# Altium schematic sheet PCB_3U_ADC.schdoc: 3U ADC - top
size 420 x 297 mm; Author: G.K.; CompanyName: WUT; DrawnBy: G.K.; Organization: CERN; Address1: Warsaw Univeristy of Technology; Address2: Nowowiejska 15/19; DocumentNumber: 1; Revision: -; SheetNumber: 1; SheetTotal: 5; EDA_Number: ARTIQ; Projet: 3U ADC; ModifiedBy: -; CreateDate: XX/XX/XXXX; CheckedDate: -; Title2: 8 channel ADC v1.2; DivGrp: ISE; Designer: G.K.; ModifiedDate: -; ProjectName: 3U ADC
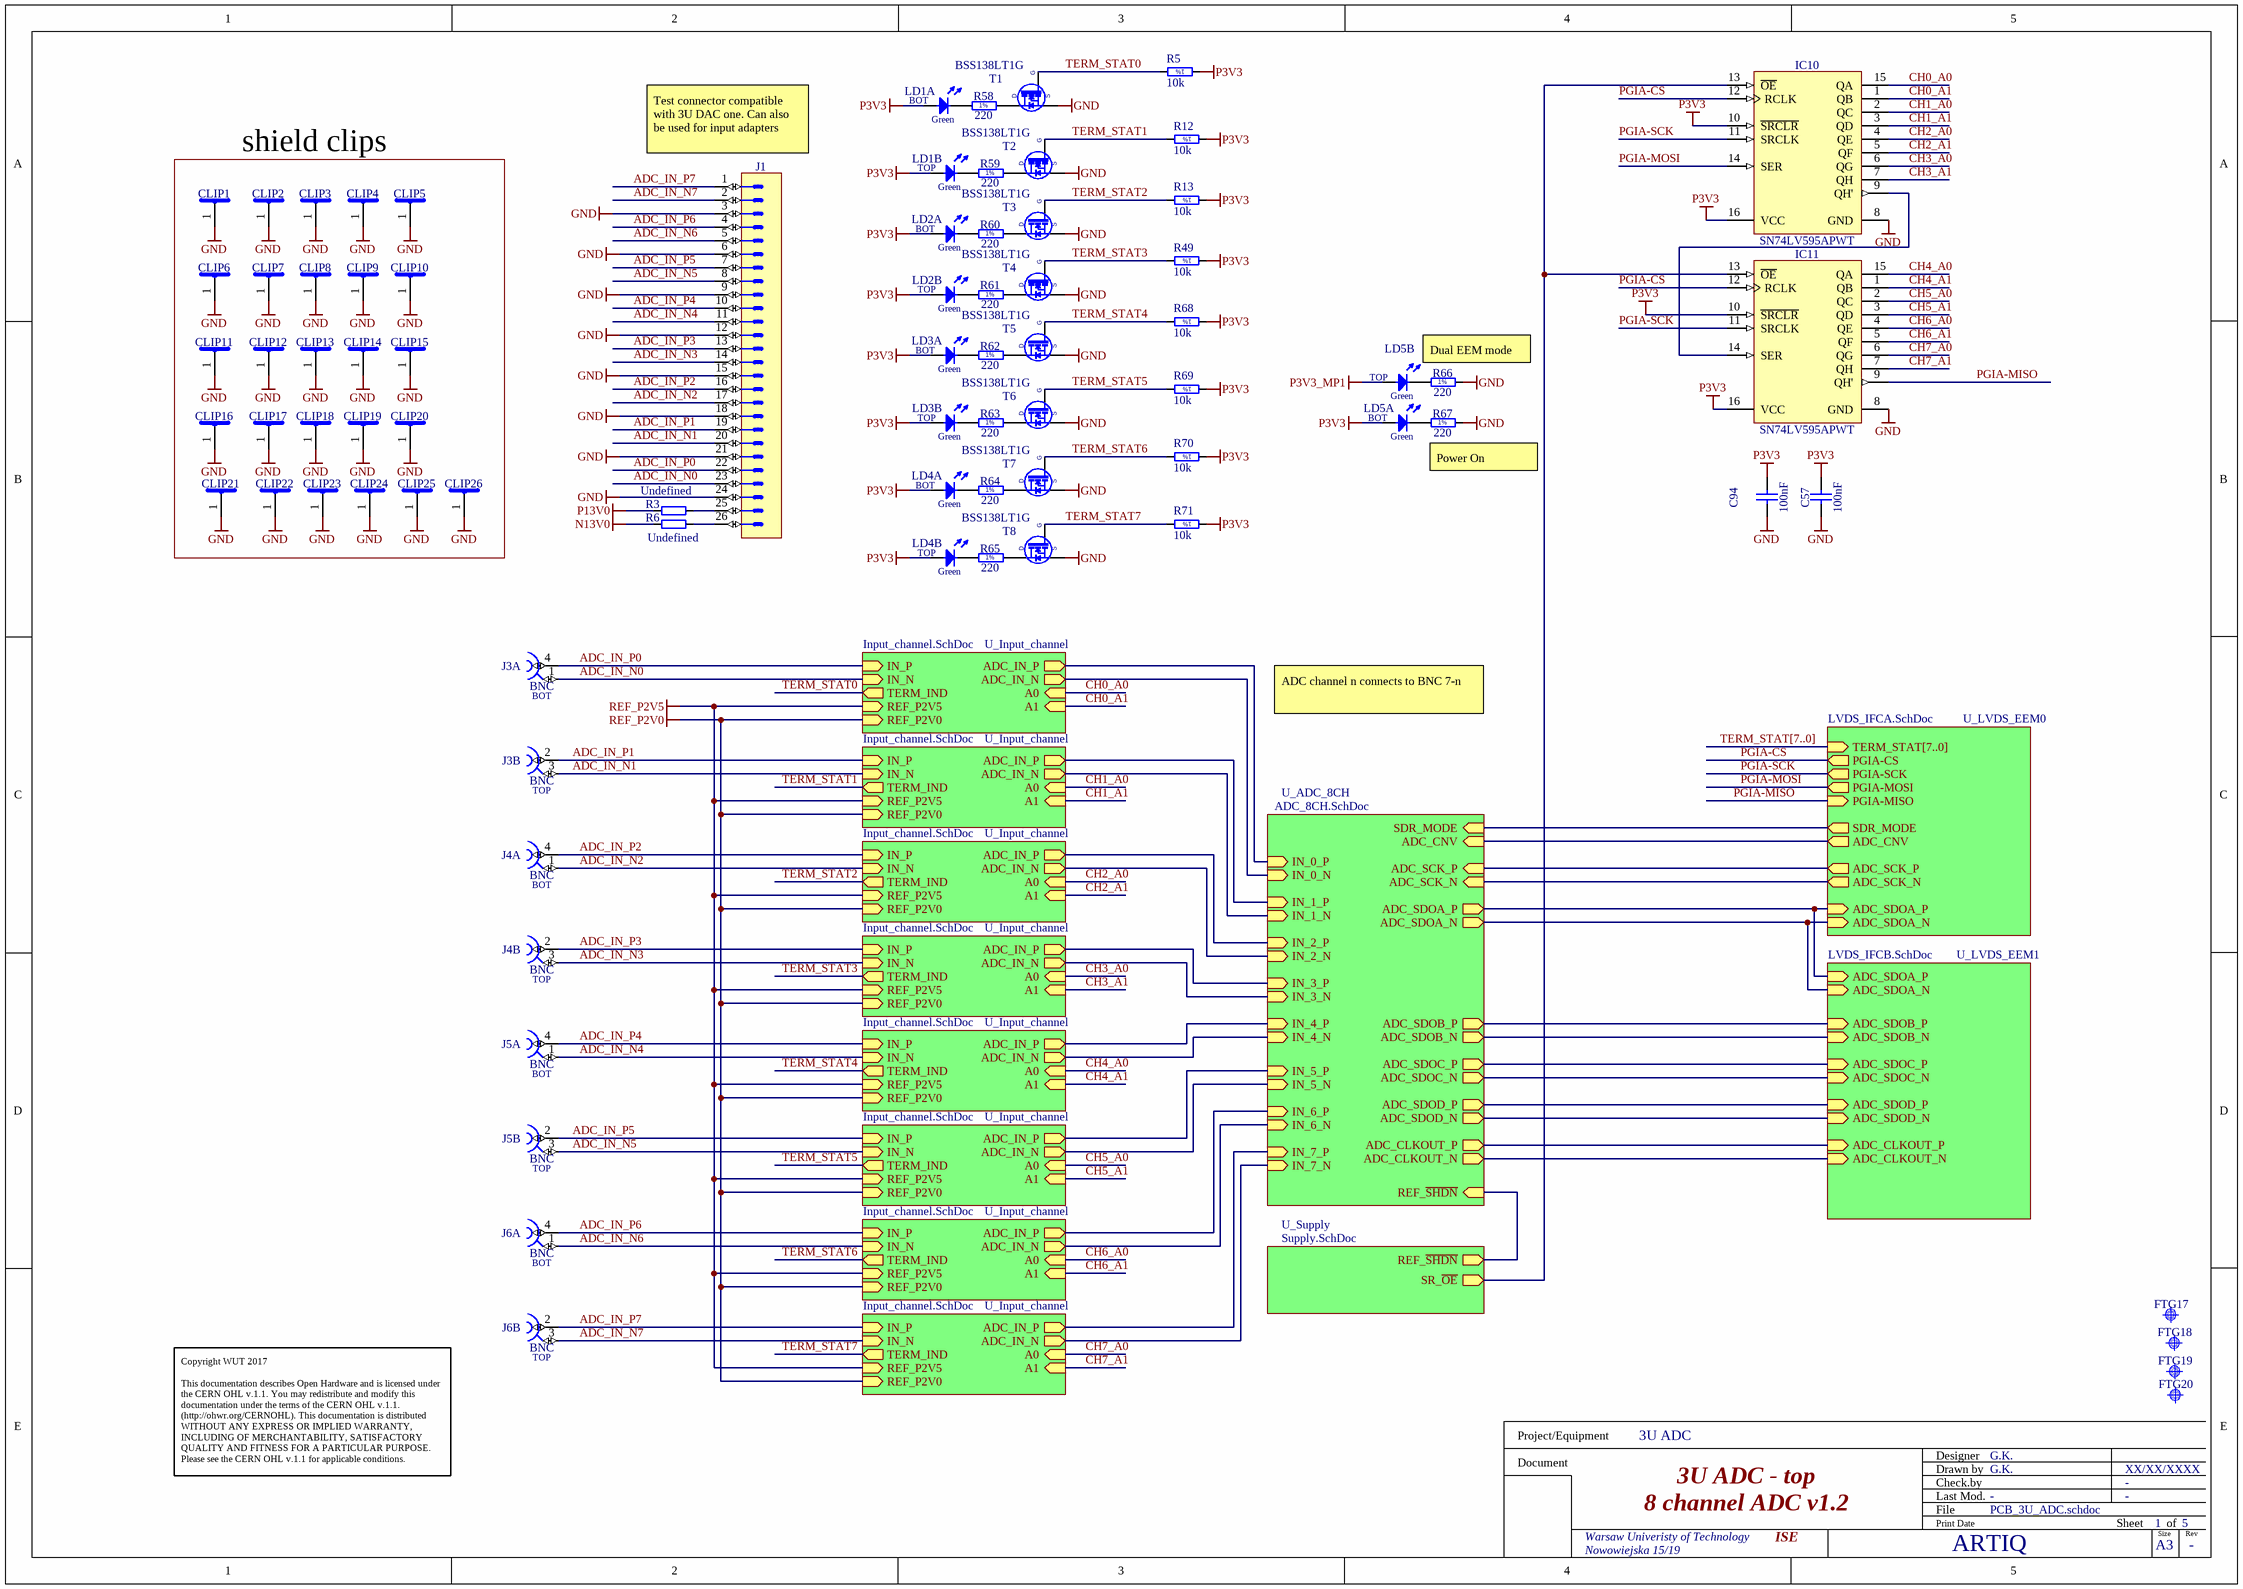
[diagram p0: PCB_3U_ADC.schdoc]

## Parts
C57  100nF  [CAPC1608X87N]
C94  100nF  [CAPC1608X87N]
CLIP1  S1411-46R  [CLIP_HOLLAND-SHIELDING_LC]  (value not drawn)
CLIP2  S1411-46R  [CLIP_HOLLAND-SHIELDING_LC]  (value not drawn)
CLIP3  S1411-46R  [CLIP_HOLLAND-SHIELDING_LC]  (value not drawn)
CLIP4  S1411-46R  [CLIP_HOLLAND-SHIELDING_LC]  (value not drawn)
CLIP5  S1411-46R  [CLIP_HOLLAND-SHIELDING_LC]  (value not drawn)
CLIP6  S1411-46R  [CLIP_HOLLAND-SHIELDING_LC]  (value not drawn)
CLIP7  S1411-46R  [CLIP_HOLLAND-SHIELDING_LC]  (value not drawn)
CLIP8  S1411-46R  [CLIP_HOLLAND-SHIELDING_LC]  (value not drawn)
CLIP9  S1411-46R  [CLIP_HOLLAND-SHIELDING_LC]  (value not drawn)
CLIP10  S1411-46R  [CLIP_HOLLAND-SHIELDING_LC]  (value not drawn)
CLIP11  S1411-46R  [CLIP_HOLLAND-SHIELDING_LC]  (value not drawn)
CLIP12  S1411-46R  [CLIP_HOLLAND-SHIELDING_LC]  (value not drawn)
CLIP13  S1411-46R  [CLIP_HOLLAND-SHIELDING_LC]  (value not drawn)
CLIP14  S1411-46R  [CLIP_HOLLAND-SHIELDING_LC]  (value not drawn)
CLIP15  S1411-46R  [CLIP_HOLLAND-SHIELDING_LC]  (value not drawn)
CLIP16  S1411-46R  [CLIP_HOLLAND-SHIELDING_LC]  (value not drawn)
CLIP17  S1411-46R  [CLIP_HOLLAND-SHIELDING_LC]  (value not drawn)
CLIP18  S1411-46R  [CLIP_HOLLAND-SHIELDING_LC]  (value not drawn)
CLIP19  S1411-46R  [CLIP_HOLLAND-SHIELDING_LC]  (value not drawn)
CLIP20  S1411-46R  [CLIP_HOLLAND-SHIELDING_LC]  (value not drawn)
CLIP21  S1411-46R  [CLIP_HOLLAND-SHIELDING_LC]  (value not drawn)
CLIP22  S1411-46R  [CLIP_HOLLAND-SHIELDING_LC]  (value not drawn)
CLIP23  S1411-46R  [CLIP_HOLLAND-SHIELDING_LC]  (value not drawn)
CLIP24  S1411-46R  [CLIP_HOLLAND-SHIELDING_LC]  (value not drawn)
CLIP25  S1411-46R  [CLIP_HOLLAND-SHIELDING_LC]  (value not drawn)
CLIP26  S1411-46R  [CLIP_HOLLAND-SHIELDING_LC]  (value not drawn)
FTG17  Use only in PCB  [FIDUCIAL_TOP_C100-200]  (value not drawn)
FTG18  Use only in PCB  [FIDUCIAL_TOP_S100-200]  (value not drawn)
FTG19  Use only in PCB  [FIDUCIAL_TOP_S200-400]  (value not drawn)
FTG20  Use only in PCB  [FIDUCIAL_TOP_S100-200]  (value not drawn)
IC10  SN74LV595APWT  [SOP65P640X120-16N]
IC11  SN74LV595APWT  [SOP65P640X120-16N]
J1  Header 26  [3M_N2526-6002RB]  (value not drawn)
J3  BNC  [RENHOTEC_RHT-610-0049]  (parts A,B of 2)
J4  BNC  [RENHOTEC_RHT-610-0049]  (parts A,B of 2)
J5  BNC  [RENHOTEC_RHT-610-0049]  (parts A,B of 2)
J6  BNC  [RENHOTEC_RHT-610-0049]  (parts A,B of 2)
LD1  Green/Green  [LED_DIALIGHT_571-0122F]  (value not drawn)  (parts A,B of 2)
LD2  Green/Green  [LED_DIALIGHT_571-0122F]  (value not drawn)  (parts A,B of 2)
LD3  Green/Green  [LED_DIALIGHT_571-0122F]  (value not drawn)  (parts A,B of 2)
LD4  Green/Green  [LED_DIALIGHT_571-0122F]  (value not drawn)  (parts A,B of 2)
LD5  Green/Green  [LED_DIALIGHT_571-0122F]  (value not drawn)  (parts A,B of 2)
R3  Undefined  [RESC1608X55N]
R5  10k  [RESC1005X40N]
R6  Undefined  [RESC1608X55N]
R12  10k  [RESC1005X40N]
R13  10k  [RESC1005X40N]
R49  10k  [RESC1005X40N]
R58  220  [RESC1608X55N]
R59  220  [RESC1608X55N]
R60  220  [RESC1608X55N]
R61  220  [RESC1608X55N]
R62  220  [RESC1608X55N]
R63  220  [RESC1608X55N]
R64  220  [RESC1608X55N]
R65  220  [RESC1608X55N]
R66  220  [RESC1608X55N]
R67  220  [RESC1608X55N]
R68  10k  [RESC1005X40N]
R69  10k  [RESC1005X40N]
R70  10k  [RESC1005X40N]
R71  10k  [RESC1005X40N]
T1  BSS138LT1G  [SOT95P240X110-3N]
T2  BSS138LT1G  [SOT95P240X110-3N]
T3  BSS138LT1G  [SOT95P240X110-3N]
T4  BSS138LT1G  [SOT95P240X110-3N]
T5  BSS138LT1G  [SOT95P240X110-3N]
T6  BSS138LT1G  [SOT95P240X110-3N]
T7  BSS138LT1G  [SOT95P240X110-3N]
T8  BSS138LT1G  [SOT95P240X110-3N]

## Blocks framed on the sheet
shield clips: CLIP1-CLIP26

## Sub-sheets
U_ADC_8CH = ADC_8CH.SchDoc: IN_1_P (in), IN_2_P (in), IN_0_P (in), IN_3_P (in), IN_4_P (in), IN_5_P (in), IN_6_P (in), IN_7_P (in), IN_0_N (in), IN_1_N (in), IN_2_N (in), IN_3_N (in), IN_6_N (in), IN_7_N (in), IN_4_N (in), IN_5_N (in), ADC_SDOA_P (out), ADC_SDOA_N (out), ADC_SCK_P (in), ADC_SCK_N (in), ADC_CNV (in), ADC_SDOB_N (out), ADC_SDOB_P (out), ADC_SDOC_P (out), ADC_SDOC_N (out), ADC_SDOD_N (out), ADC_SDOD_P (out), ADC_CLKOUT_P (out), ADC_CLKOUT_N (out), SDR_MODE (in), REF_~{SHDN} (in)
U_Input_channel = Input_channel.SchDoc: IN_N (in), A0 (in), A1 (in), IN_P (in), TERM_IND (out), ADC_IN_N (out), ADC_IN_P (out), REF_P2V5 (in), REF_P2V0 (in)
U_Input_channel = Input_channel.SchDoc: IN_N (in), A0 (in), A1 (in), IN_P (in), TERM_IND (out), ADC_IN_N (out), ADC_IN_P (out), REF_P2V5 (in), REF_P2V0 (in)
U_Input_channel = Input_channel.SchDoc: IN_N (in), A0 (in), A1 (in), IN_P (in), TERM_IND (out), ADC_IN_N (out), ADC_IN_P (out), REF_P2V5 (in), REF_P2V0 (in)
U_Input_channel = Input_channel.SchDoc: IN_N (in), A0 (in), A1 (in), IN_P (in), TERM_IND (out), ADC_IN_N (out), ADC_IN_P (out), REF_P2V5 (in), REF_P2V0 (in)
U_Input_channel = Input_channel.SchDoc: IN_N (in), A0 (in), A1 (in), IN_P (in), TERM_IND (out), ADC_IN_N (out), ADC_IN_P (out), REF_P2V5 (in), REF_P2V0 (in)
U_Input_channel = Input_channel.SchDoc: IN_N (in), A0 (in), A1 (in), IN_P (in), TERM_IND (out), ADC_IN_N (out), ADC_IN_P (out), REF_P2V5 (in), REF_P2V0 (in)
U_Input_channel = Input_channel.SchDoc: IN_N (in), A0 (in), A1 (in), IN_P (in), TERM_IND (out), ADC_IN_N (out), ADC_IN_P (out), REF_P2V5 (in), REF_P2V0 (in)
U_Input_channel = Input_channel.SchDoc: IN_N (in), A0 (in), A1 (in), IN_P (in), TERM_IND (out), ADC_IN_N (out), ADC_IN_P (out), REF_P2V5 (in), REF_P2V0 (in)
U_LVDS_EEM0 = LVDS_IFCA.SchDoc: TERM_STAT[7..0] (in), PGIA-CS (out), PGIA-SCK (out), PGIA-MOSI (out), PGIA-MISO (in), ADC_SDOA_N (in), ADC_SDOA_P (in), ADC_SCK_N (out), ADC_SCK_P (out), ADC_CNV (out), SDR_MODE (out)
U_LVDS_EEM1 = LVDS_IFCB.SchDoc: ADC_SDOB_P (in), ADC_SDOB_N (in), ADC_SDOC_P (in), ADC_SDOC_N (in), ADC_SDOD_P (in), ADC_SDOD_N (in), ADC_CLKOUT_P (in), ADC_CLKOUT_N (in), ADC_SDOA_N (in), ADC_SDOA_P (in)
U_Supply = Supply.SchDoc: REF_~{SHDN} (out), SR_~{OE} (out)

## Nets
GND: C57.1 C94.1 CLIP1.1 CLIP2.1 CLIP3.1 CLIP4.1 CLIP5.1 CLIP6.1 CLIP7.1 CLIP8.1 CLIP9.1 CLIP10.1 CLIP11.1 CLIP12.1 CLIP13.1 CLIP14.1 CLIP15.1 CLIP16.1 CLIP17.1 CLIP18.1 CLIP19.1 CLIP20.1 CLIP21.1 CLIP22.1 CLIP23.1 CLIP24.1 CLIP25.1 CLIP26.1 IC10.8(GND) IC11.8(GND) J1.3 J1.6 J1.9 J1.12 J1.15 J1.18 J1.21 J1.24 R66.2 R67.2 T1.2(S) T2.2(S) T3.2(S) T4.2(S) T5.2(S) T6.2(S) T7.2(S) T8.2(S)
N13V0: R6.2
P3V3: C57.2 C94.2 IC10.10(~{SRCLR}) IC10.16(VCC) IC11.10(~{SRCLR}) IC11.16(VCC) LD1.2(A) LD1.4(A) LD2.2(A) LD2.4(A) LD3.2(A) LD3.4(A) LD4.2(A) LD4.4(A) LD5.2(A) R5.1 R12.1 R13.1 R49.1 R68.1 R69.1 R70.1 R71.1
P3V3_MP1: LD5.4(A)
P13V0: R3.2
REF_P2V0: sheet U_Input_channel/REF_P2V0, sheet U_Input_channel/REF_P2V0, sheet U_Input_channel/REF_P2V0, sheet U_Input_channel/REF_P2V0, sheet U_Input_channel/REF_P2V0, sheet U_Input_channel/REF_P2V0, sheet U_Input_channel/REF_P2V0, sheet U_Input_channel/REF_P2V0
REF_P2V5: sheet U_Input_channel/REF_P2V5, sheet U_Input_channel/REF_P2V5, sheet U_Input_channel/REF_P2V5, sheet U_Input_channel/REF_P2V5, sheet U_Input_channel/REF_P2V5, sheet U_Input_channel/REF_P2V5, sheet U_Input_channel/REF_P2V5, sheet U_Input_channel/REF_P2V5
ADC_IN_N0: J1.23 J3.1 ; sheet U_Input_channel/IN_N
ADC_IN_N1: J1.20 J3.3 ; sheet U_Input_channel/IN_N
ADC_IN_N2: J1.17 J4.1 ; sheet U_Input_channel/IN_N
ADC_IN_N3: J1.14 J4.3 ; sheet U_Input_channel/IN_N
ADC_IN_N4: J1.11 J5.1 ; sheet U_Input_channel/IN_N
ADC_IN_N5: J1.8 J5.3 ; sheet U_Input_channel/IN_N
ADC_IN_N6: J1.5 J6.1 ; sheet U_Input_channel/IN_N
ADC_IN_N7: J1.2 J6.3 ; sheet U_Input_channel/IN_N
ADC_IN_P0: J1.22 J3.4 ; sheet U_Input_channel/IN_P
ADC_IN_P1: J1.19 J3.2 ; sheet U_Input_channel/IN_P
ADC_IN_P2: J1.16 J4.4 ; sheet U_Input_channel/IN_P
ADC_IN_P3: J1.13 J4.2 ; sheet U_Input_channel/IN_P
ADC_IN_P4: J1.10 J5.4 ; sheet U_Input_channel/IN_P
ADC_IN_P5: J1.7 J5.2 ; sheet U_Input_channel/IN_P
ADC_IN_P6: J1.4 J6.4 ; sheet U_Input_channel/IN_P
ADC_IN_P7: J1.1 J6.2 ; sheet U_Input_channel/IN_P
CH0_A0: IC10.15(QA) ; sheet U_Input_channel/A0
CH0_A1: IC10.1(QB) ; sheet U_Input_channel/A1
CH1_A0: IC10.2(QC) ; sheet U_Input_channel/A0
CH1_A1: IC10.3(QD) ; sheet U_Input_channel/A1
CH2_A0: IC10.4(QE) ; sheet U_Input_channel/A0
CH2_A1: IC10.5(QF) ; sheet U_Input_channel/A1
CH3_A0: IC10.6(QG) ; sheet U_Input_channel/A0
CH3_A1: IC10.7(QH) ; sheet U_Input_channel/A1
CH4_A0: IC11.15(QA) ; sheet U_Input_channel/A0
CH4_A1: IC11.1(QB) ; sheet U_Input_channel/A1
CH5_A0: IC11.2(QC) ; sheet U_Input_channel/A0
CH5_A1: IC11.3(QD) ; sheet U_Input_channel/A1
CH6_A0: IC11.4(QE) ; sheet U_Input_channel/A0
CH6_A1: IC11.5(QF) ; sheet U_Input_channel/A1
CH7_A0: IC11.6(QG) ; sheet U_Input_channel/A0
CH7_A1: IC11.7(QH) ; sheet U_Input_channel/A1
PGIA-CS: IC10.12(RCLK) IC11.12(RCLK) ; sheet U_LVDS_EEM0/PGIA-CS
PGIA-MISO: IC11.9(QH') ; sheet U_LVDS_EEM0/PGIA-MISO
PGIA-MOSI: IC10.14(SER) ; sheet U_LVDS_EEM0/PGIA-MOSI
PGIA-SCK: IC10.11(SRCLK) IC11.11(SRCLK) ; sheet U_LVDS_EEM0/PGIA-SCK
TERM_STAT0: R5.2 T1.1(G) ; sheet U_Input_channel/TERM_IND
TERM_STAT1: R12.2 T2.1(G) ; sheet U_Input_channel/TERM_IND
TERM_STAT2: R13.2 T3.1(G) ; sheet U_Input_channel/TERM_IND
TERM_STAT3: R49.2 T4.1(G) ; sheet U_Input_channel/TERM_IND
TERM_STAT4: R68.2 T5.1(G) ; sheet U_Input_channel/TERM_IND
TERM_STAT5: R69.2 T6.1(G) ; sheet U_Input_channel/TERM_IND
TERM_STAT6: R70.2 T7.1(G) ; sheet U_Input_channel/TERM_IND
TERM_STAT7: R71.2 T8.1(G) ; sheet U_Input_channel/TERM_IND
NetIC10_9: IC10.9(QH') IC11.14(SER)
NetIC10_13: IC10.13(~{OE}) IC11.13(~{OE}) ; sheet U_Supply/SR_~{OE}
NetJ1_25: J1.25 R3.1
NetJ1_26: J1.26 R6.1
NetLD1_1: LD1.1(C) R58.1
NetLD1_3: LD1.3(C) R59.1
NetLD2_1: LD2.1(C) R60.1
NetLD2_3: LD2.3(C) R61.1
NetLD3_1: LD3.1(C) R62.1
NetLD3_3: LD3.3(C) R63.1
NetLD4_1: LD4.1(C) R64.1
NetLD4_3: LD4.3(C) R65.1
NetLD5_1: LD5.1(C) R67.1
NetLD5_3: LD5.3(C) R66.1
NetR58_2: R58.2 T1.3(D)
NetR59_2: R59.2 T2.3(D)
NetR60_2: R60.2 T3.3(D)
NetR61_2: R61.2 T4.3(D)
NetR62_2: R62.2 T5.3(D)
NetR63_2: R63.2 T6.3(D)
NetR64_2: R64.2 T7.3(D)
NetR65_2: R65.2 T8.3(D)
(unnamed): sheet U_ADC_8CH/IN_1_P, sheet U_Input_channel/ADC_IN_P
(unnamed): sheet U_ADC_8CH/IN_2_P, sheet U_Input_channel/ADC_IN_P
(unnamed): sheet U_ADC_8CH/IN_0_P, sheet U_Input_channel/ADC_IN_P
(unnamed): sheet U_ADC_8CH/IN_3_P, sheet U_Input_channel/ADC_IN_P
(unnamed): sheet U_ADC_8CH/IN_4_P, sheet U_Input_channel/ADC_IN_P
(unnamed): sheet U_ADC_8CH/IN_5_P, sheet U_Input_channel/ADC_IN_P
(unnamed): sheet U_ADC_8CH/IN_6_P, sheet U_Input_channel/ADC_IN_P
(unnamed): sheet U_ADC_8CH/IN_7_P, sheet U_Input_channel/ADC_IN_P
(unnamed): sheet U_ADC_8CH/IN_0_N, sheet U_Input_channel/ADC_IN_N
(unnamed): sheet U_ADC_8CH/IN_1_N, sheet U_Input_channel/ADC_IN_N
(unnamed): sheet U_ADC_8CH/IN_2_N, sheet U_Input_channel/ADC_IN_N
(unnamed): sheet U_ADC_8CH/IN_3_N, sheet U_Input_channel/ADC_IN_N
(unnamed): sheet U_ADC_8CH/IN_6_N, sheet U_Input_channel/ADC_IN_N
(unnamed): sheet U_ADC_8CH/IN_7_N, sheet U_Input_channel/ADC_IN_N
(unnamed): sheet U_ADC_8CH/IN_4_N, sheet U_Input_channel/ADC_IN_N
(unnamed): sheet U_ADC_8CH/IN_5_N, sheet U_Input_channel/ADC_IN_N
(unnamed): sheet U_ADC_8CH/ADC_SDOA_P, sheet U_LVDS_EEM0/ADC_SDOA_P, sheet U_LVDS_EEM1/ADC_SDOA_P
(unnamed): sheet U_ADC_8CH/ADC_SDOA_N, sheet U_LVDS_EEM0/ADC_SDOA_N, sheet U_LVDS_EEM1/ADC_SDOA_N
(unnamed): sheet U_ADC_8CH/ADC_SCK_P, sheet U_LVDS_EEM0/ADC_SCK_P
(unnamed): sheet U_ADC_8CH/ADC_SCK_N, sheet U_LVDS_EEM0/ADC_SCK_N
(unnamed): sheet U_ADC_8CH/ADC_CNV, sheet U_LVDS_EEM0/ADC_CNV
(unnamed): sheet U_ADC_8CH/ADC_SDOB_N, sheet U_LVDS_EEM1/ADC_SDOB_N
(unnamed): sheet U_ADC_8CH/ADC_SDOB_P, sheet U_LVDS_EEM1/ADC_SDOB_P
(unnamed): sheet U_ADC_8CH/ADC_SDOC_P, sheet U_LVDS_EEM1/ADC_SDOC_P
(unnamed): sheet U_ADC_8CH/ADC_SDOC_N, sheet U_LVDS_EEM1/ADC_SDOC_N
(unnamed): sheet U_ADC_8CH/ADC_SDOD_N, sheet U_LVDS_EEM1/ADC_SDOD_N
(unnamed): sheet U_ADC_8CH/ADC_SDOD_P, sheet U_LVDS_EEM1/ADC_SDOD_P
(unnamed): sheet U_ADC_8CH/ADC_CLKOUT_P, sheet U_LVDS_EEM1/ADC_CLKOUT_P
(unnamed): sheet U_ADC_8CH/ADC_CLKOUT_N, sheet U_LVDS_EEM1/ADC_CLKOUT_N
(unnamed): sheet U_ADC_8CH/SDR_MODE, sheet U_LVDS_EEM0/SDR_MODE
(unnamed): sheet U_ADC_8CH/REF_~{SHDN}, sheet U_Supply/REF_~{SHDN}

## Buses and harness runs
bus TERM_STAT[7..0] = sheet U_LVDS_EEM0/TERM_STAT[7..0]

## Notes on the sheet
- (near J1) Test connector compatible with 3U DAC one. Can also be used for input adapters
- Dual EEM mode
- Power On
- ADC channel n connects to BNC 7-n
- Copyright WUT 2017
  This documentation describes Open Hardware and is licensed under the CERN OHL v.1.1. You may redistribute and modify this documentation under the terms of the CERN OHL v.1.1. (http://ohwr.org/CERNOHL). This documentation is distributed WITHOUT ANY EXPRESS OR IMPLIED WARRANTY, INCLUDING OF MERCHANTABILITY, SATISFACTORY QUALITY AND FITNESS FOR A PARTICULAR PURPOSE. Please see the CERN OHL v.1.1 for applicable conditions.
- Project/Equipment
- Document
- Designer
- Drawn by
- Check.by
- File
- Last Mod.
- Print Date
- Sheet
- Size
- A3
- of
- Rev
- (in symbol CON_BNC_DUAL, part A) BOT
- (in symbol CON_BNC_DUAL, part B) TOP
- (in symbol LED_DIALIGHT_571-0122F, part A) BOT; Green
- (in symbol LED_DIALIGHT_571-0122F, part B) TOP; Green
- (in symbol R0402_10K_1%_0.0625W_100PPM) 1%
- (in symbol R0603_220R_1%_0.1W_100PPM) 1%

## Library data of the parts
C57 C94 = CC0603_100NF_50V_10%_X7R: Non-polarised capacitor; Part Description: SMD Multilayer Chip Ceramic Capacitor; Manufacturer: GENERIC; Manufacturer1 Part Number: 223858615649; Voltage: 50V; TC: X7R; Tolerance: ±10%; Part Number: CC0603_100NF_50V_10%_X7R; Component Kind: Standard; Component Type: Standard; Pin Count: 2; Value: 100nF; Status: Preferred; Manufacturer Part Number: CC0603_100NF_50V_10%_X7R; Case: 0603; Mounted: Yes; Socket: No; SMD: Yes; Sense: No; Manufacturer1 Example: PHYCOMP; Manufacturer1 ComponentHeight: 0.87mm; HelpURL: \\cern.ch\dfs\Applications\Altium\Datasheets\CC0603_X7R_PHYCOMP.pdf; Author: CERN DEM JLC; CreateDate: 03.12.2007; LatestRevisionDate: 03.12.2007
CLIP1-CLIP26 = SHIELD_CLIP: Surface Mount Clip for PCB Screening Covers; Part Description: Surface Mount Clip for PCB Screening Covers, 1500 Serie; Manufacturer: HARWIN; PressFit: No; Table: Metal Screening Box; Part Number: S1411-46R; Component Kind: Standard; Component Type: Standard; Pin Count: 1; PackageDescription: Surface Mount Clip for PCB Screening Covers, 1500 Serie; Mounted: Yes; Socket: No; SMD: Yes; Status: None; Manufacturer Part Number: S1411-46R; ComponentHeight: 3.5mm; HelpURL: \\cern.ch\dfs\Applications\Altium\Datasheets\CLIP_HOLLAND-SHIELDING_LC.pdf; Author: CERN DEM JLC; CreateDate: 2013-06-25; LatestRevisionDate: 2013-06-25
FTG17 = FIDUCIAL_TARGET_C100-200: Fiducial Target; Part Description: Round Fiducial Target, Top Layer, 1.0mm, Top Solder 2.0mm, Keepout =2.0mm; Mounted: No; Part Number: FIDUCIAL_TARGET_C100-200; Component Kind: Standard (No BOM); Component Type: Standard (No BOM); Pin Count: 1; Family: Fiducial; Socket: No; SMD: Yes; Sense: No; Status: None; ComponentHeight: 0mm; HelpURL: Undefined; Author: CERN DEM JLC; CreateDate: 09.02.2010; LatestRevisionDate: 04.04.2012; PackageDescription: Round Fiducial Target, Top Layer, 1.0mm, Top Solder 2.0mm, Keepout =2.0mm
FTG18 FTG20 = FIDUCIAL_TARGET_S100-200: Fiducial Target; Part Description: Square Fiducial Target, Top Layer, 1.0mm, Top Solder 2.0mm, Keepout =2.0mm; Mounted: No; Part Number: FIDUCIAL_TARGET_S100-200; Component Kind: Standard (No BOM); Component Type: Standard (No BOM); Pin Count: 1; Family: Fiducial; Socket: No; SMD: Yes; Sense: No; Status: None; ComponentHeight: 0mm; HelpURL: Undefined; Author: CERN DEM JLC; CreateDate: 09.02.2010; LatestRevisionDate: 04.04.2012; PackageDescription: Square Fiducial Target, Top Layer, 1.0mm, Top Solder 2.0mm, Keepout =2.0mm
FTG19 = FIDUCIAL_TARGET_S200-400: Fiducial Target; Part Description: Square Fiducial Target, Top Layer, 2.0mm, Top Solder 4.0mm, Keepout =4.0mm; Mounted: No; Part Number: FIDUCIAL_TARGET_S200-400; Component Kind: Standard (No BOM); Component Type: Standard (No BOM); Pin Count: 1; Family: Fiducial; Socket: No; SMD: Yes; Sense: No; Status: None; ComponentHeight: 0mm; HelpURL: Undefined; Author: CERN DEM JLC; CreateDate: 02.06.2008; LatestRevisionDate: 04.04.2012; PackageDescription: Square Fiducial Target, Top Layer, 2.0mm, Top Solder 4.0mm, Keepout =4.0mm
IC10 IC11 = SN74LV595APWT: 8-Bit Shift Register With 3-State Output Register; Manufacturer: TEXAS INSTRUMENTS; PressFit: No; Bonding: No; Part Number: SN74LV595APWT; Component Kind: Standard; Component Type: Standard; Device: SN74LV595APWT; PackageDescription: SOP, 0.65mm pitch; 16 pin, 4.40mm W X 5.00mm L X 1.20mm H body IPC Medium Density; Part Description: 8-Bit Shift Register With 3-State Output Register; Manufacturer Part Number: SN74LV595APWT; Pin Count: 16; Case: TSSOP16; Mounted: Yes; Socket: No; SMD: Yes; Sense: No; ComponentHeight: 1.2mm; Author: CERN DEM JLC; HelpURL: \\cern.ch\dfs\Applications\Altium\Datasheets\SN74LV595APWT.pdf; CreateDate: 10.05.2012; LatestRevisionDate: 10.05.2012
J1 = 3M_N2526-6002RB: Connector 26 Male; Part Description: 26 Contacts - Straight .100'' x .100'' Low Profile Four-Wall Header, 2500 Series; Manufacturer: 3M; PressFit: No; Part Number: 3M_N2526-6002RB; Component Kind: Standard; Component Type: Standard; Pin Count: 26; Family: Header 26; Mounted: Yes; Socket: No; SMD: No; Sense: No; Status: None; Manufacturer Part Number: N2526-6002RB; ComponentHeight: 10.03mm; HelpURL: \\cern.ch\dfs\Applications\Altium\Datasheets\3M_N2526-6002RB.pdf; Author: CERN DEM JLC; CreateDate: 11.02.2009; LatestRevisionDate: 11.08.2009
J3-J6 = CON_BNC_DUAL: Dual Right Angle 50 Ohm BNC Jack, White Valox Case; Manufacturer: RENHOTEC; Manufacturer Part Number: RHT-610-0049; PressFit: No; Part Number: RENHOTEC_RHT-610-0049; Component Kind: Standard; Component Type: Standard; Pin Count: 6; Family: BNC; Mounted: Yes; Socket: No; SMD: No; Sense: No; Status: None; Part Description: Dual Right Angle 50 Ohm BNC Jack, White Valox Case; ComponentHeight: 29.3mm; HelpURL: \\cern.ch\dfs\Applications\Altium\Datasheets\BOMAR_364A2595.pdf; Author: GK; CreateDate: 09.04.2013; LatestRevisionDate: 09.04.2013
LD1-LD5 = LED_DIALIGHT_571-0122F: LED x2 Green 1C2A-BOT_3C4A-TOP; Part Description: Dual 2mm Green LEDs CBI® Circuit Board Indicator (Without positioning pins); PressFit: No; Bonding: No; Part Number: LED_DIALIGHT_571-0122F; Component Kind: Standard; Component Type: Standard; Color: Green/Green; PackageDescription: 2x 2mm Red LED PCB Edge Mounting (Without positioning pins) DIALIGHT 571 Serie; Manufacturer: DIALIGHT; Manufacturer Part Number: 571-0122F; Pin Count: 4; Mounted: Yes; Socket: No; SMD: No; Sense: No; ComponentHeight: 8.6mm; HelpURL: \\cern.ch\dfs\Applications\Altium\Datasheets\LED_DIALIGHT_571-0122F.pdf; Author: CERN DEM JLC; CreateDate: 09.11.2009; LatestRevisionDate: 17.03.2010
R3 R6 = R0603_NO-VALUE: Resistor; Part Description: Reserved Footprint For a 0603 (1608) Chip Resistor; Mounted: No; Part Number: R0603_NO-VALUE; Component Kind: Standard; Component Type: Standard; Pin Count: 2; Value: Undefined; Status: None; Manufacturer: Undefined; Manufacturer Part Number: R0603_NO-VALUE; Case: 0603; Sense: No; Socket: No; SMD: Yes; Manufacturer1 Example: Undefined; Manufacturer1 Part Number: Undefined; Manufacturer1 ComponentHeight: Undefined; HelpURL: Undefined; Author: CERN DEM JLC; CreateDate: 03.12.2007; LatestRevisionDate: 13.03.2008
R5 R12 R13 R49 R68-R71 = R0402_10K_1%_0.0625W_100PPM: Resistor - 1%; Part Description: General Purpose Thick Film Chip Resistor; Manufacturer: GENERIC; Manufacturer1 Part Number: 232270671003L; TC: ±100ppm/°C; Part Number: R0402_10K_1%_0.0625W_100PPM; Component Kind: Standard; Component Type: Standard; Pin Count: 2; Value: 10k; Status: Not recommended; Power: 0.0625W; Tolerance: ±1%; Manufacturer Part Number: R0402_10K_1%_0.0625W_100PPM; Case: 0402; Mounted: Yes; Sense: No; Socket: No; SMD: Yes; Manufacturer1 Example: YAGEO PHYCOMP; Manufacturer1 ComponentHeight: 0.4mm; HelpURL: \\cern.ch\dfs\Applications\Altium\Datasheets\R0402_Phycomp_RC0402.pdf; Author: CERN DEM JLC; CreateDate: 03.12.2007; LatestRevisionDate: 17.10.2012
R58-R67 = R0603_220R_1%_0.1W_100PPM: Resistor - 1%; Part Description: General Purpose Thick Film Chip Resistor; Manufacturer: GENERIC; Manufacturer1 Part Number: NRC06F2200TRF; Power: 0.1W; TC: ±100ppm/°C; Part Number: R0603_220R_1%_0.1W_100PPM; Component Kind: Standard; Component Type: Standard; Pin Count: 2; Value: 220; Status: Preferred; Tolerance: ±1%; Manufacturer Part Number: R0603_220R_1%_0.1W_100PPM; Case: 0603; Mounted: Yes; Sense: No; Socket: No; SMD: Yes; Manufacturer1 Example: NIC COMPONENT; Manufacturer1 ComponentHeight: 0.55mm; HelpURL: \\cern.ch\dfs\Applications\Altium\Datasheets\R0603_NIC_NRC.pdf; Author: CERN DEM JLC; CreateDate: 03.12.2007; LatestRevisionDate: 13.03.2008
T1-T8 = BSS138LT1G: N-CHANNEL MOSFET WITH DIODE; Part Description: 50V 200mA N-Channel Enhancement Mode Field-Effect Transistor; Manufacturer: ON SEMICONDUCTOR; PressFit: No; Bonding: No; Part Number: BSS138LT1G; Component Kind: Standard; Component Type: Standard; Device: BSS138LT1G; PackageDescription: SOT23 3-Leads, Pitch 0.95mm - Body 1.4x3mm, IPC Medium Density; Manufacturer Part Number: BSS138LT1G; Pin Count: 3; Case: SOT23-3; Mounted: Yes; Socket: No; SMD: Yes; Sense: No; ComponentHeight: 1.11mm; HelpURL: \\cern.ch\dfs\Applications\Altium\Datasheets\BSS138LT1G.pdf; Author: CERN DEM JLC; CreateDate: 23.03.2009; LatestRevisionDate: 23.03.2009